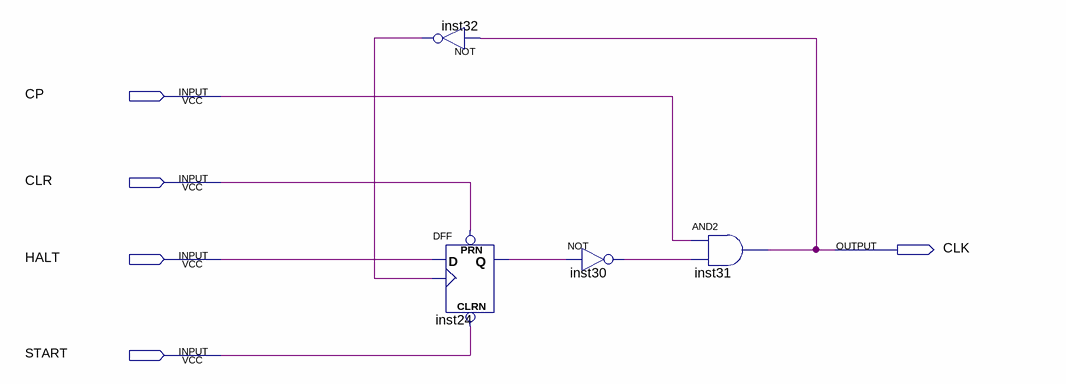
[diagram p0: schematic sheet]
// Quartus schematic start_stop.bdf as structural Verilog: 4 symbols, 5 pins
module start_stop (
  input  CP,
  input  CLR,
  input  HALT,
  input  START,
  output CLK
);

  wire inst24_q, inst30_out, inst32_out;

  not inst32 (inst32_out, CLK);
  DFF inst24 (.CLRN(START), .CLK(inst32_out), .D(HALT), .PRN(CLR), .Q(inst24_q));
  not inst30 (inst30_out, inst24_q);
  and inst31 (CLK, CP, inst30_out);
endmodule
